# EAGLE design theFlower (EAGLE 6.5.0)
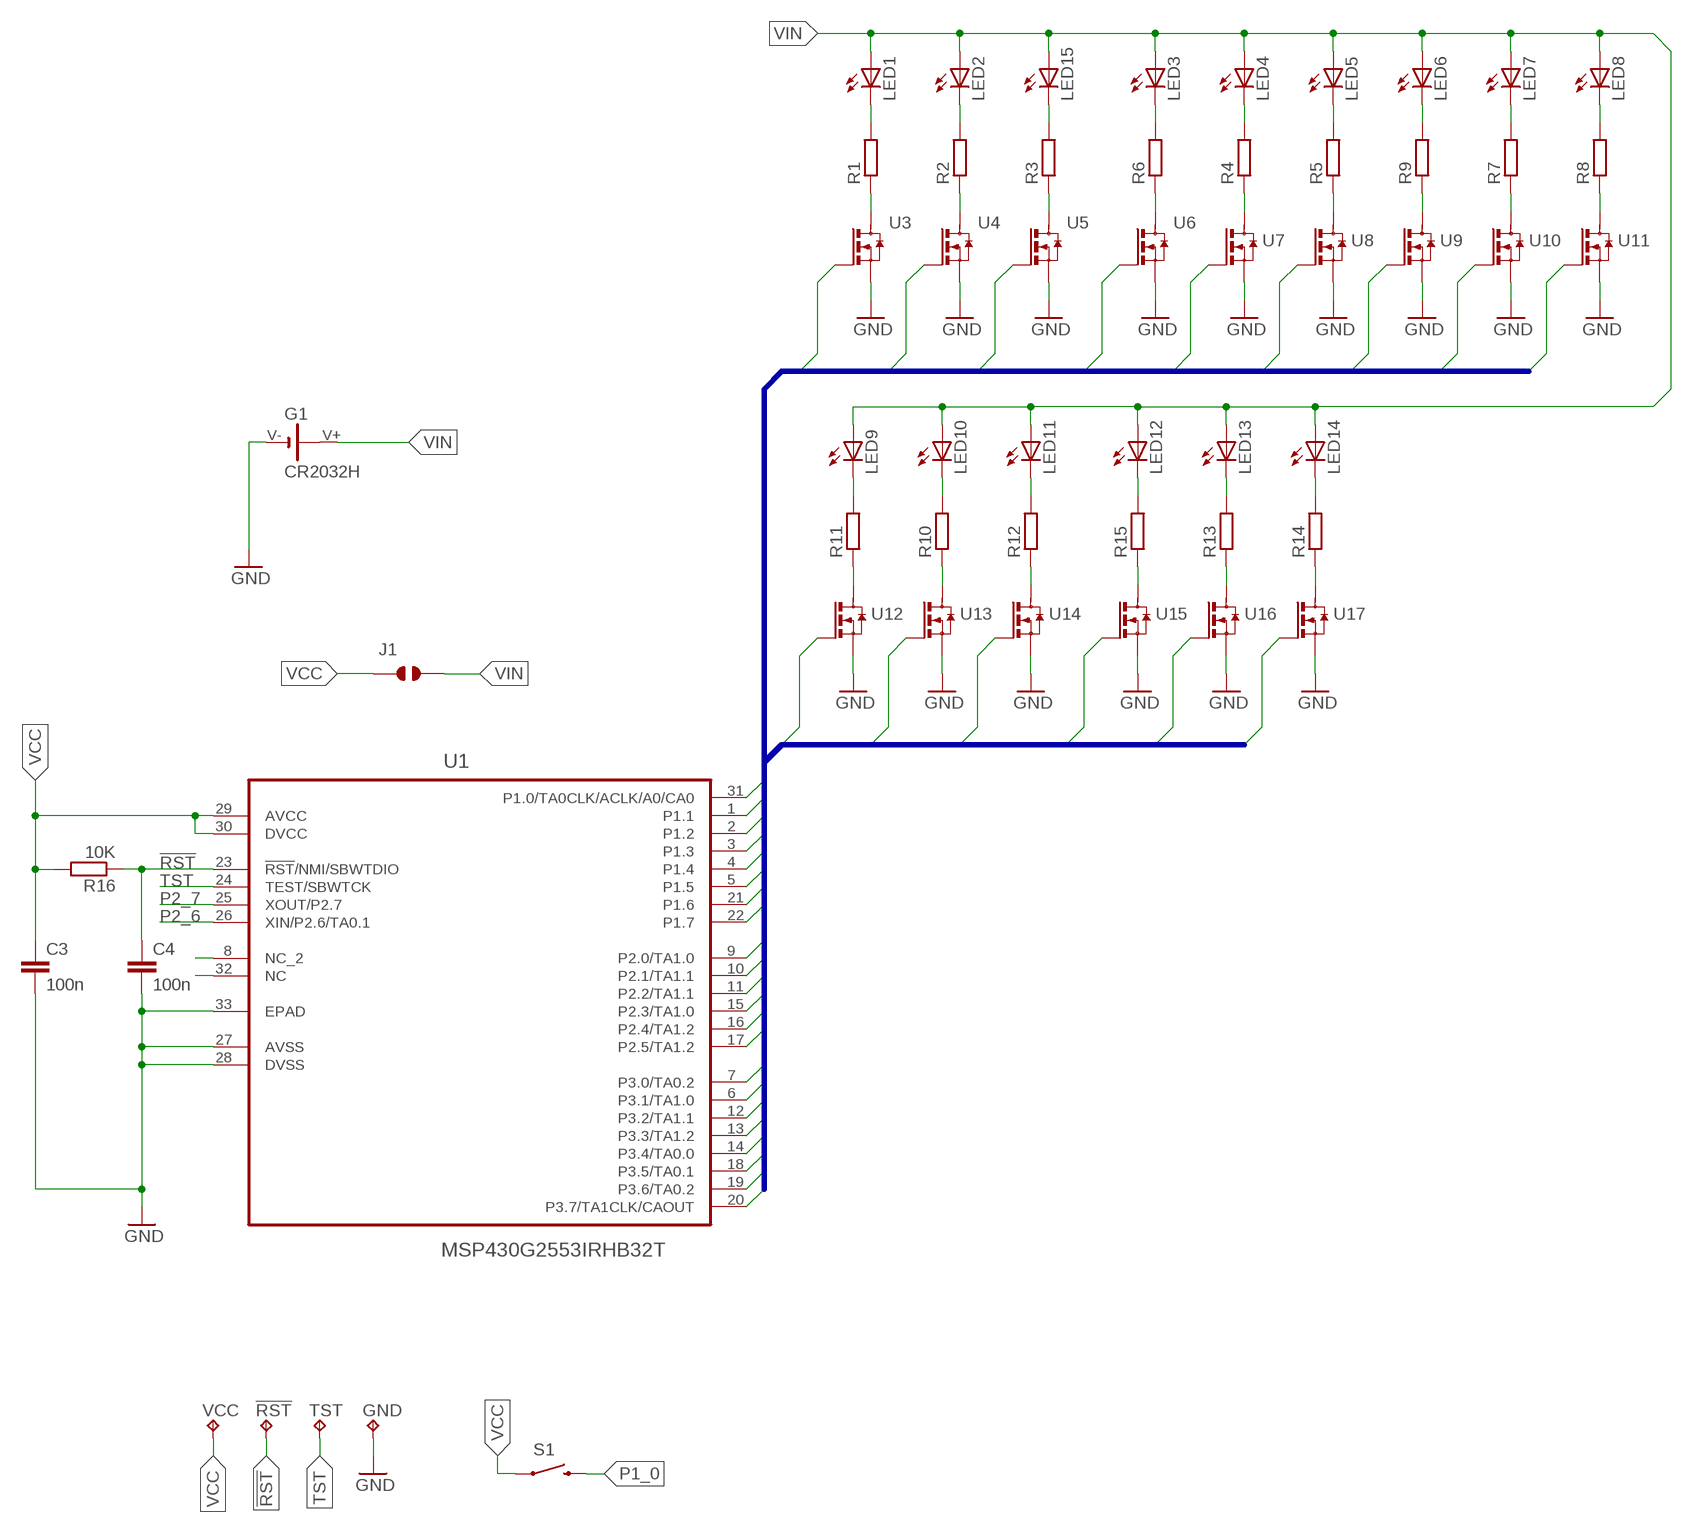
[diagram p0: schematic, sheet 1]

## Parts
!RST!  TPAD0.8MM_RUND  [TPAD_0.8MM_RUND]
C3  100n  C-EUC0603  [C0603]
C4  100n  C-EUC0603  [C0603]
G1  CR2032H  [CH7410-2032LF]
GND  TPAD0.8MM_RUND  [TPAD_0.8MM_RUND]
J1  JUMPER_SOLDER_1X2  [JUMPER_SOLDER_1X2]
LED1  LEDCHIP-LED0805  [CHIP-LED0805]
LED2  LEDCHIP-LED0805  [CHIP-LED0805]
LED3  LEDCHIP-LED0805  [CHIP-LED0805]
LED4  LEDCHIP-LED0805  [CHIP-LED0805]
LED5  LEDCHIP-LED0805  [CHIP-LED0805]
LED6  LEDCHIP-LED0805  [CHIP-LED0805]
LED7  LEDCHIP-LED0805  [CHIP-LED0805]
LED8  LEDCHIP-LED0805  [CHIP-LED0805]
LED9  LEDCHIP-LED0805  [CHIP-LED0805]
LED10  LEDCHIP-LED0805  [CHIP-LED0805]
LED11  LEDCHIP-LED0805  [CHIP-LED0805]
LED12  LEDCHIP-LED0805  [CHIP-LED0805]
LED13  LEDCHIP-LED0805  [CHIP-LED0805]
LED14  LEDCHIP-LED0805  [CHIP-LED0805]
LED15  LEDCHIP-LED0805  [CHIP-LED0805]
R1  R-EU_R0603  [R0603]
R2  R-EU_R0603  [R0603]
R3  R-EU_R0603  [R0603]
R4  R-EU_R0603  [R0603]
R5  R-EU_R0603  [R0603]
R6  R-EU_R0603  [R0603]
R7  R-EU_R0603  [R0603]
R8  R-EU_R0603  [R0603]
R9  R-EU_R0603  [R0603]
R10  R-EU_R0603  [R0603]
R11  R-EU_R0603  [R0603]
R12  R-EU_R0603  [R0603]
R13  R-EU_R0603  [R0603]
R14  R-EU_R0603  [R0603]
R15  R-EU_R0603  [R0603]
R16  10K  R-EU_R0603  [R0603]
S1  SWITCH-MOMENTARY-2SMD  [TACTILE-SWITCH-SMD]
TST  TPAD0.8MM_RUND  [TPAD_0.8MM_RUND]
U1  MSP430G2553IRHB32T  [QFN50P500X500X100-33N]
U3  BSS138BKW  [SOT65P210X110-3N]
U4  BSS138BKW  [SOT65P210X110-3N]
U5  BSS138BKW  [SOT65P210X110-3N]
U6  BSS138BKW  [SOT65P210X110-3N]
U7  BSS138BKW  [SOT65P210X110-3N]
U8  BSS138BKW  [SOT65P210X110-3N]
U9  BSS138BKW  [SOT65P210X110-3N]
U10  BSS138BKW  [SOT65P210X110-3N]
U11  BSS138BKW  [SOT65P210X110-3N]
U12  BSS138BKW  [SOT65P210X110-3N]
U13  BSS138BKW  [SOT65P210X110-3N]
U14  BSS138BKW  [SOT65P210X110-3N]
U15  BSS138BKW  [SOT65P210X110-3N]
U16  BSS138BKW  [SOT65P210X110-3N]
U17  BSS138BKW  [SOT65P210X110-3N]
VCC  TPAD0.8MM_RUND  [TPAD_0.8MM_RUND]

## Nets
!RST!: !RST!.1(TP) C4.1 R16.1 U1.23(!RST!/NMI/SBWTDIO)
GND: C3.2 C4.2 G1.V- GND.1(TP) U1.27(AVSS) U1.28(DVSS) U1.33(EPAD) U3.2(S) U4.2(S) U5.2(S) U6.2(S) U7.2(S) U8.2(S) U9.2(S) U10.2(S) U11.2(S) U12.2(S) U13.2(S) U14.2(S) U15.2(S) U16.2(S) U17.2(S)
N$1: LED1.C R1.2
N$2: LED2.C R2.2
N$3: LED15.C R3.2
N$4: LED4.C R4.2
N$5: LED5.C R5.2
N$6: LED3.C R6.2
N$7: LED7.C R7.2
N$8: LED8.C R8.2
N$9: LED6.C R9.2
N$10: LED10.C R10.2
N$11: LED9.C R11.2
N$12: LED11.C R12.2
N$13: LED13.C R13.2
N$14: LED14.C R14.2
N$15: LED12.C R15.2
N$16: R1.1 U3.3(D)
N$17: R2.1 U4.3(D)
N$18: R3.1 U5.3(D)
N$19: R6.1 U6.3(D)
N$20: R4.1 U7.3(D)
N$21: R5.1 U8.3(D)
N$22: R9.1 U9.3(D)
N$24: R7.1 U10.3(D)
N$25: R8.1 U11.3(D)
N$26: R11.1 U12.3(D)
N$27: R10.1 U13.3(D)
N$28: R12.1 U14.3(D)
N$29: R15.1 U15.3(D)
N$30: R13.1 U16.3(D)
N$31: R14.1 U17.3(D)
NC: U1.32(NC)
NC_2: U1.8(NC_2)
P1_0: S1.3 U1.31(P1.0/TA0CLK/ACLK/A0/CA0)
P1_1: U1.1(P1.1) U5.1(G)
P1_2: U1.2(P1.2) U3.1(G)
P1_3: U1.3(P1.3) U4.1(G)
P1_4: U1.4(P1.4) U6.1(G)
P1_5: U1.5(P1.5) U7.1(G)
P1_6: U1.21(P1.6) U16.1(G)
P1_7: U1.22(P1.7) U17.1(G)
P2_0: U1.9(P2.0/TA1.0) U10.1(G)
P2_1: U1.10(P2.1/TA1.1) U11.1(G)
P2_2: U1.11(P2.2/TA1.1) U12.1(G)
P2_3: U1.15(P2.3/TA1.0)
P2_4: U1.16(P2.4/TA1.2)
P2_5: U1.17(P2.5/TA1.2)
P2_6: U1.26(XIN/P2.6/TA0.1)
P2_7: U1.25(XOUT/P2.7)
P3_0: U1.7(P3.0/TA0.2) U9.1(G)
P3_1: U1.6(P3.1/TA1.0) U8.1(G)
P3_2: U1.12(P3.2/TA1.1) U13.1(G)
P3_3: U1.13(P3.3/TA1.2) U14.1(G)
P3_4: U1.14(P3.4/TA0.0)
P3_5: U1.18(P3.5/TA0.1)
P3_6: U1.19(P3.6/TA0.2)
P3_7: U1.20(P3.7/TA1CLK/CAOUT) U15.1(G)
TST: TST.1(TP) U1.24(TEST/SBWTCK)
VCC: C3.1 J1.1 R16.2 S1.1 U1.29(AVCC) U1.30(DVCC) VCC.1(TP)
VIN: G1.V+ J1.2 LED1.A LED2.A LED3.A LED4.A LED5.A LED6.A LED7.A LED8.A LED9.A LED10.A LED11.A LED12.A LED13.A LED14.A LED15.A

## Buses
P1_[0..7],P2_[0..5],P3_[0..7]

## Library data of the parts
!RST! GND TST VCC = MOT_GPDLV-V2:TPAD
C3 C4 = rcl:C-EU: CAPACITOR, European symbol
G1 = my_library:CR2032H: LI BATTERY Varta
J1 = dp_devices:JUMPER_SOLDER_1X2
LED1-LED15 = led:LED: LED OSRAM: - CHIPLED LG R971, LG N971, LY N971, LG Q971, LY Q971, LO R971, LY R971 LH N974, LH R974 LS Q976, LO Q976, LY Q976 LO Q996 - Hyper CHIPLED LW Q18S LB Q993, LB Q99A, LB R99A - SideLED LS A670, LO A670, LY A670, LG A670, LP A670 LB A673, LV A673, LT A673, LW A673 LH A674 LY A675 LS A676, LA A676, LO A676, LY A676, LW A676 LS A679, LY A679, LG A679 - Hyper Micro SIDELED® LS Y876, LA Y876, LO Y876, LY Y876 LT Y87S - SmartLED LW L88C, LW L88S LB L89C, LB L89S, LG L890 LS L89K, LO L89K, LY L89K LS L896, LA L896, LO L896, LY L896 - TOPLED LS T670, LO T670, LY T670, LG T670, LP T670 LSG T670, LSP T670, LSY T670, LOP T670, LYG T670 LG T671, LOG T671, LSG T671 LB T673, LV T673, LT T673, LW T673 LH T674 LS T676, LA T676, LO T676, LY T676, LB T676, LH T676, LSB T676, LW T676 LB T67C, LV T67C, LT T67C, LS T67K, LO T67K, LY T67K, LW E67C LS E67B, LA E67B, LO E67B, LY E67B, LB E67C, LV E67C, LT E67C LW T67C LS T679, LY T679, LG T679 LS T770, LO T770, LY T770, LG T770, LP T770 LB T773, LV T773, LT T773, LW T773 LH T774 LS E675, LA E675, LY E675, LS T675 LS T776, LA T776, LO T776, LY T776, LB T776 LHGB T686 LT T68C, LB T68C - Hyper Mini TOPLED® LB M676 - Mini TOPLED Santana® LG M470 LS M47K, LO M47K, LY M47K Source: http://www.osram.convergy.de LUXEON: - LUMILED® LXK2-PW12-R00, LXK2-PW12-S00, LXK2-PW14-U00, LXK2-PW14-V00 LXK2-PM12-R00, LXK2-PM12-S00, LXK2-PM14-U00 LXK2-PE12-Q00, LXK2-PE12-R00, LXK2-PE12-S00, LXK2-PE14-T00, LXK2-PE14-U00 LXK2-PB12-K00, LXK2-PB12-L00, LXK2-PB12-M00, LXK2-PB14-N00, LXK2-PB14-P00, LXK2-PB14-Q00 LXK2-PR12-L00, LXK2-PR12-M00, LXK2-PR14-Q00, LXK2-PR14-R00 LXK2-PD12-Q00, LXK2-PD12-R00, LXK2-PD12-S00 LXK2-PH12-R00, LXK2-PH12-S00 LXK2-PL12-P00, LXK2-PL12-Q00, LXK2-PL12-R00 Source: www.luxeon.com KINGBRIGHT: KA-3528ASYC Source: www.kingbright.com
R1-R16 = rcl:R-EU_: RESISTOR, European symbol
S1 = SparkFun-Electromechanical:SWITCH-MOMENTARY-2: Various NO switches- pushbuttons, reed, etc; PROD_ID: SWCH-08247
U1 = my_library:MSP430G2553IRHB32T: MIXED SIGNAL MICROCONTROLLER,QFN-32; MPN: MSP430G2553IRHB32T; OC_FARNELL: 1903590; OC_NEWARK: 48T4379; PACKAGE: QFN-32; SUPPLIER: TEXAS INSTRUMENTS
U3-U17 = transistor-small-signal:BSS138BKW: N-channel Trench MOSFET; MPN: BSS138BKW; OC_FARNELL: 2053836; OC_NEWARK: 61T7488; PACKAGE: SOT-23-3; SUPPLIER: NXP

## Board
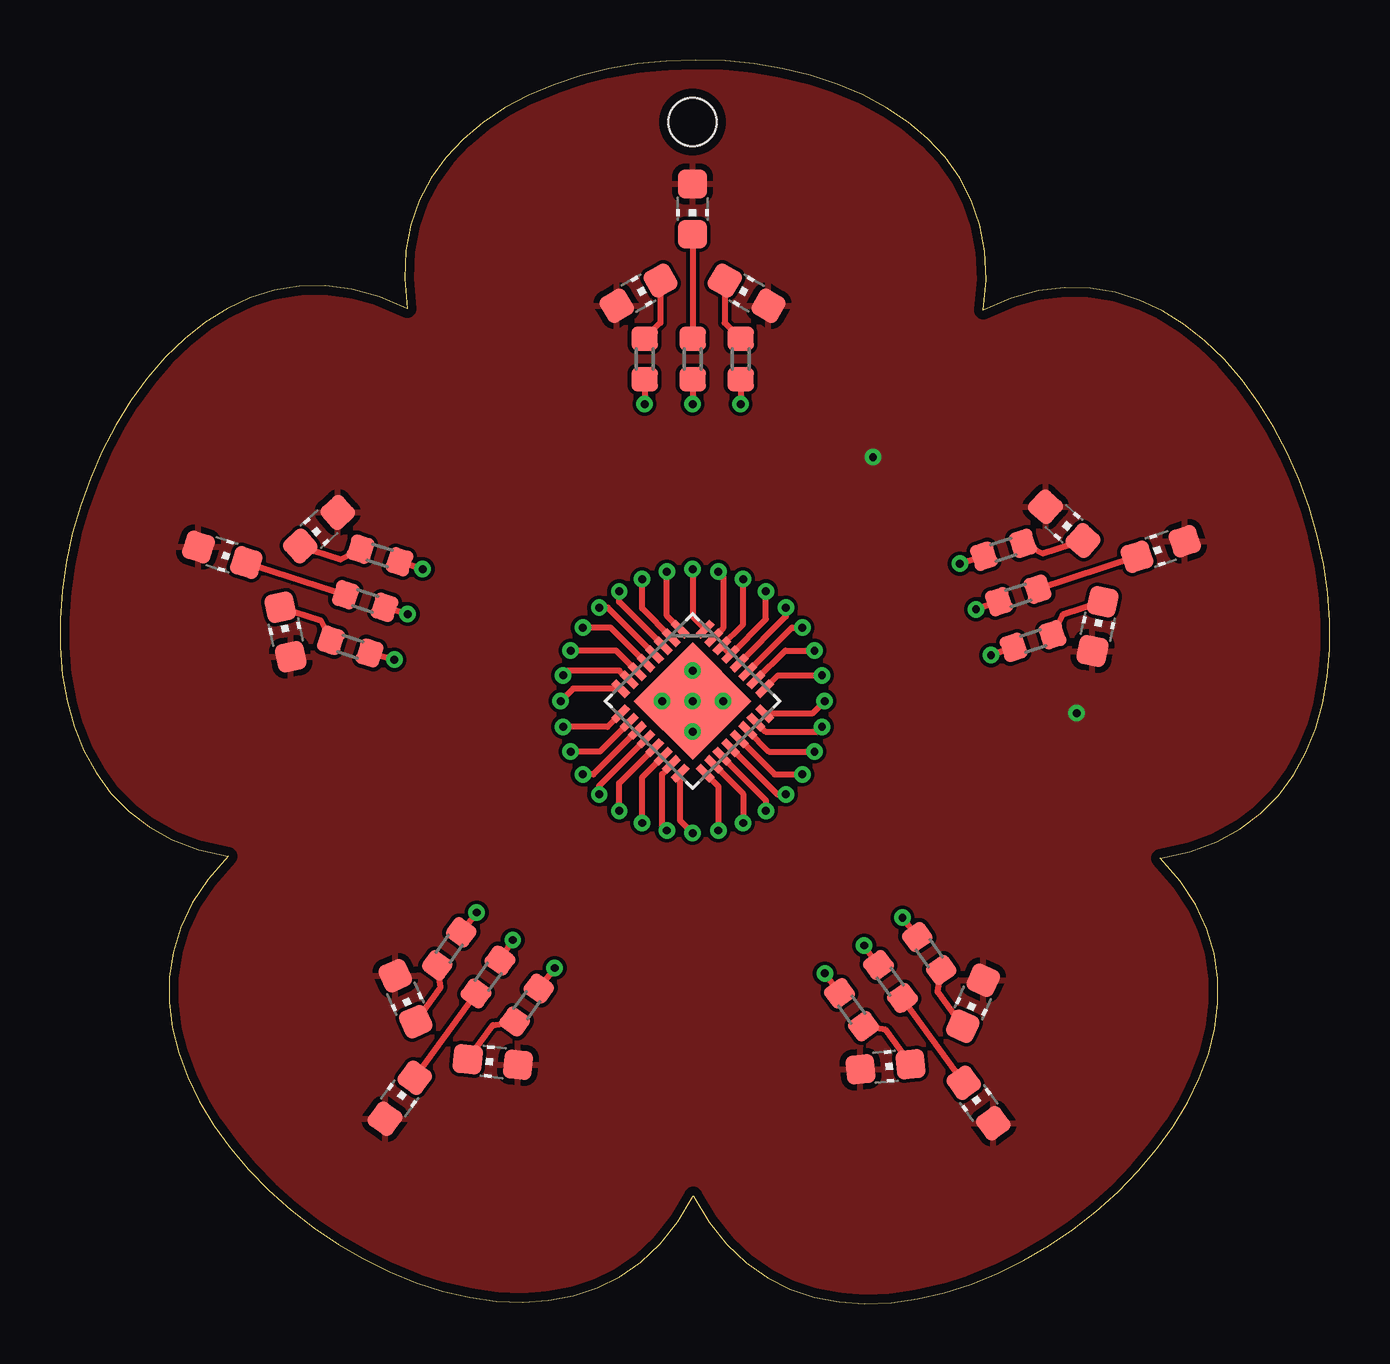
[diagram p1: board, top side]
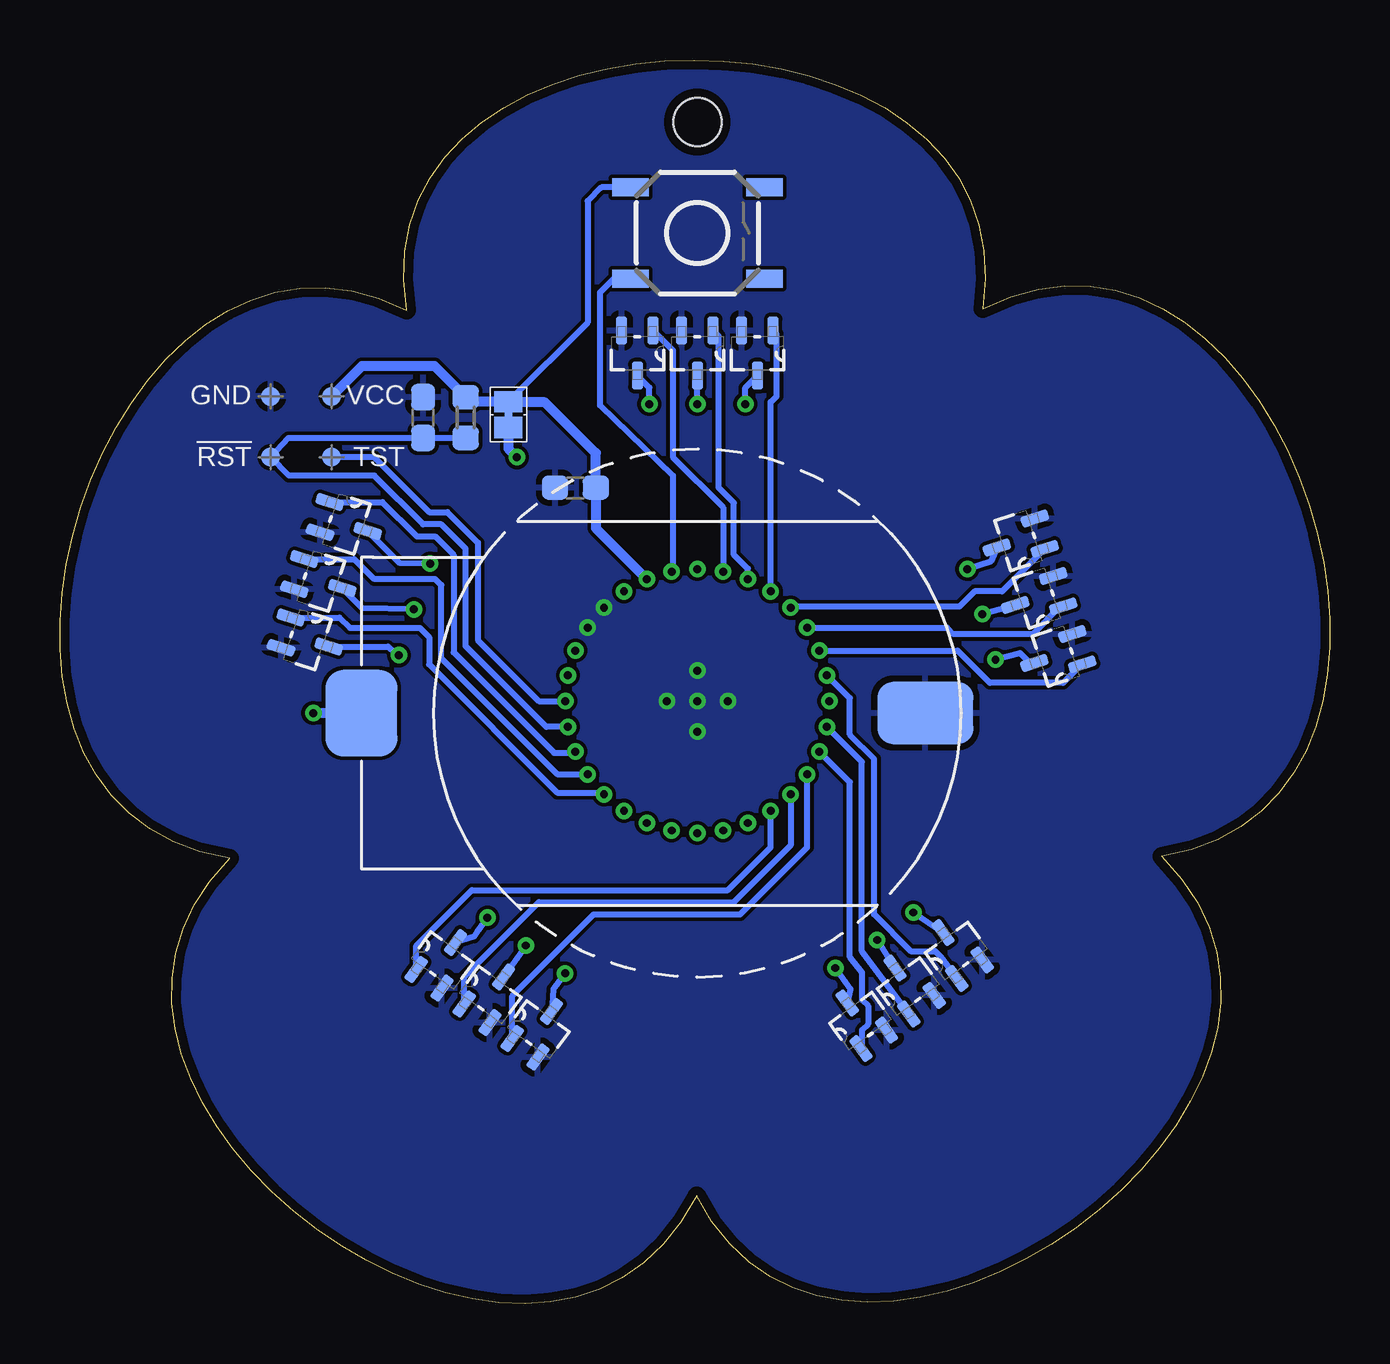
[diagram p2: board, bottom side, seen from below]

Size 52.91 x 51.82 mm. Coordinates in mm from the lower left corner, seen from the top.
Outline: 26.39,4.49 27.04,3.4 27.78,2.47 28.6,1.7 29.48,1.08 30.43,0.61 31.42,0.28 32.46,0.08 33.53,0 34.63,0.04 35.74,0.2 36.85,0.46 37.97,0.82 39.07,1.27 40.15,1.8 41.21,2.42 42.22,3.11 43.18,3.86 44.09,4.67 44.94,5.54 45.71,6.45 46.39,7.4 46.98,8.38 47.47,9.39 47.85,10.42 48.12,11.46 48.25,12.51 48.24,13.56 48.09,14.6 47.78,15.62 47.31,16.63 46.67,17.61 45.84,18.55 47.08,18.84 48.19,19.25 49.18,19.79 50.04,20.44 50.78,21.19 51.4,22.04 51.91,22.96 52.32,23.96 52.62,25.01 52.81,26.12 52.91,27.26 52.91,28.43 52.83,29.62 52.65,30.81 52.39,32 52.05,33.18 51.63,34.33 51.14,35.45 50.57,36.52 49.95,37.53 49.25,38.47 48.5,39.34 47.69,40.12 46.83,40.8 45.92,41.37 44.97,41.82 43.97,42.14 42.93,42.32 41.86,42.34 40.76,42.2 39.63,41.89 38.48,41.4 38.59,42.66 38.54,43.85 38.33,44.95 37.98,45.97 37.49,46.91 36.88,47.76 36.16,48.54 35.34,49.23 34.43,49.84 33.44,50.37 32.38,50.81 31.27,51.18 30.11,51.46 28.92,51.66 27.71,51.78 26.48,51.82 25.26,51.78 24.05,51.66 22.86,51.45 21.7,51.17 20.59,50.8 19.53,50.35 18.54,49.82 17.63,49.22 16.8,48.53 16.08,47.76 15.47,46.91 14.98,45.98 14.62,44.97 14.41,43.87 14.36,42.7 14.47,41.45 13.31,41.95 12.16,42.27 11.05,42.41 9.97,42.39 8.93,42.22 7.93,41.9 6.97,41.46 6.06,40.89 5.2,40.21 4.39,39.43 3.64,38.57 2.95,37.62 2.32,36.61 1.76,35.54 1.27,34.42 0.86,33.27 0.52,32.09 0.26,30.9 0.09,29.7 0,28.51 0,27.34 0.1,26.2 0.3,25.09 0.6,24.04 1,23.04 1.51,22.12 2.13,21.27 2.86,20.52 3.71,19.87 4.68,19.33 5.78,18.92 7.01,18.64 6.17,17.69 5.51,16.7 5.03,15.68 4.72,14.65 4.56,13.61 4.55,12.56 4.68,11.51 4.94,10.46 5.32,9.44 5.81,8.43 6.4,7.44 7.09,6.5 7.86,5.59 8.7,4.72 9.61,3.91 10.58,3.16 11.6,2.48 12.65,1.86 13.73,1.33 14.84,0.88 15.95,0.52 17.07,0.26 18.18,0.11 19.28,0.06 20.35,0.14 21.39,0.33 22.38,0.66 23.32,1.13 24.21,1.74 25.02,2.5 25.75,3.41 26.39,4.49
Copper layers (1*16): Top 0.0356mm / dielectric 1.5011mm / Bottom 0.0356mm
Design rules "LaenPCBOrder *": minimum track width 6mil, minimum drill 13mil, track to track 6mil, track to pad 6mil, pad to pad 6mil, via to via 6mil, smd to smd 6mil, copper to edge 15mil, drill to drill 6mil, minimum pad ring 7mil, minimum via ring 7mil, stop-mask expansion 3mil, vias tented up to drill 25mil, thermal gap 10mil
Holes 2 mm at 26.36,49.23

### Footprints (pad centres in the part's own frame; a part is rotated, then mirrored left to right if it is on the bottom)
TPAD_0.8MM_RUND = smd 0.8 x 0.8: 1 0,0
C0603 = smd 1.1 x 1: 1 -0.85,0; 2 0.85,0
CH7410-2032LF = smd 3 x 3.6: V+ -14,0 | smd 4 x 2.6: V- 9.5,0
JUMPER_SOLDER_1X2 = smd 0.889 x 1.168: 1 -0.533,0; 2 0.533,0 | smd 1.27 x 0.318: P$1 0,0
CHIP-LED0805 = smd 1.2 x 1.2: A 0,-1.05; C 0,1.05
R0603 = smd 1 x 1.1: 1 -0.85,0; 2 0.85,0
TACTILE-SWITCH-SMD = smd 1.524 x 0.762: 1 -2.794,1.905; 2 2.794,1.905; 3 -2.794,-1.905; 4 2.794,-1.905
QFN50P500X500X100-33N = smd 0.813 x 0.305: 1 -2.489,1.753; 2 -2.489,1.245; 3 -2.489,0.762; 4 -2.489,0.254; 5 -2.489,-0.254; 6 -2.489,-0.762; 7 -2.489,-1.245; 8 -2.489,-1.753; 17 2.489,-1.753; 18 2.489,-1.245; 19 2.489,-0.762; 20 2.489,-0.254; 21 2.489,0.254; 22 2.489,0.762; 23 2.489,1.245; 24 2.489,1.753 | smd 0.305 x 0.813: 9 -1.753,-2.489; 10 -1.245,-2.489; 11 -0.762,-2.489; 12 -0.254,-2.489; 13 0.254,-2.489; 14 0.762,-2.489; 15 1.245,-2.489; 16 1.753,-2.489; 25 1.753,2.489; 26 1.245,2.489; 27 0.762,2.489; 28 0.254,2.489; 29 -0.254,2.489; 30 -0.762,2.489; 31 -1.245,2.489; 32 -1.753,2.489 | smd 3.454 x 3.454: 33 0,0
SOT65P210X110-3N = smd 1.168 x 0.457: 1 -0.94,0.66; 2 -0.94,-0.66; 3 0.94,0

### Placement (x,y rotation side)
!RST!  44.14,35.27 0 bottom
C3  31.44,34 180 bottom
C4  37.79,36.92 90 bottom
G1  26.36,24.61 0 bottom
GND  44.14,37.81 0 bottom
J1  34.23,37.05 270 bottom
LED1  26.36,45.61 180 top
LED2  24.11,42.11 300 top
LED3  10.79,32.27 132 top
LED4  6.77,31.21 252 top
LED5  9.4,27.99 12 top
LED6  14.4,12.72 204 top
LED7  14.16,8.56 324 top
LED8  18.04,10.07 84 top
LED9  34.4,9.87 276 top
LED10  38.27,8.36 36 top
LED11  38.04,12.52 156 top
LED12  43.24,28.22 348 top
LED13  45.87,31.44 108 top
LED14  41.85,32.5 228 top
LED15  28.61,42.11 60 top
R1  26.36,39.36 90 top
R2  24.36,39.36 90 top
R3  28.36,39.36 90 top
R4  12.71,29.28 162 top
R5  12.09,27.37 162 top
R6  13.33,31.18 162 top
R7  17.83,13.62 234 top
R8  19.45,12.44 234 top
R9  16.22,14.79 234 top
R10  34.6,13.42 306 top
R11  32.98,12.25 306 top
R12  36.22,14.6 306 top
R13  39.93,29.51 18 top
R14  39.31,31.41 18 top
R15  40.54,27.61 18 top
R16  36.01,36.92 90 bottom
S1  26.36,44.61 0 bottom
TST  41.6,35.27 0 bottom
U1  26.36,25.11 315 top
U3  26.36,39.61 270 bottom
U4  23.86,39.61 270 bottom
U5  28.86,39.61 270 bottom
U6  12.98,31.8 198 bottom
U7  12.21,29.4 198 bottom
U8  11.42,26.98 198 bottom
U9  15.57,14.7 126 bottom
U10  17.57,13.22 126 bottom
U11  19.56,11.77 126 bottom
U12  32.98,11.42 54 bottom
U13  34.98,12.86 54 bottom
U14  36.98,14.3 54 bottom
U15  42.61,27.67 342 bottom
U16  42.05,30.11 342 bottom
U17  40.98,32.48 342 bottom
VCC  41.6,37.81 0 bottom

### Tracks (layer width: path | path; a pad name or v marks a point on that pad's centre or on a via)
!RST!  (via drill 0.33)
  Top 0.254: U1.23 29.39,23.84 31.55,23.84 v31.75,24.04
  Bottom 0.254: v31.75,24.04 32.65,24.04 36.01,27.4 36.01,31.46 37.03,32.48 37.79,32.48 39.82,34.51 43.38,34.51 !RST!.1 43.4,36.07 C4.1 R16.1
GND  (via drill 0.33, 0.33 pad 0.51)
  Top 0.254: U1.27 30.49,28.17 v30.93,28.17 | U1.28 30.25,28.64 v30.25,29
  other vias: 27.63,25.11 26.36,26.38 25.09,25.11 26.36,23.84 26.36,25.11
  pour Bottom (isolate 0.152): -1.14,-2.39 53.86,-2.39 53.86,52.61 -1.14,52.61
N$1
  Top 0.254: LED1.C R1.2
N$2
  Top 0.254: LED2.C 25.02,40.87 R2.2
N$3
  Top 0.254: LED15.C 27.7,40.87 R3.2
N$4
  Top 0.254: LED4.C R4.2
N$5
  Top 0.254: LED5.C 10.86,28.47 R5.2
N$6
  Top 0.254: LED3.C 11.69,31.02 R6.2
N$7
  Top 0.254: LED7.C R7.2
N$8
  Top 0.254: LED8.C 18.03,11.61 R8.2
N$9
  Top 0.254: LED6.C 15.86,13.18 R9.2
N$10
  Top 0.254: LED10.C R10.2
N$11
  Top 0.254: LED9.C 34.4,11.41 R11.2
N$12
  Top 0.254: LED11.C 36.57,12.99 R12.2
N$13
  Top 0.254: LED13.C R13.2
N$14
  Top 0.254: LED14.C 40.95,31.25 R14.2
N$15
  Top 0.254: LED12.C 41.78,28.7 R15.2
N$16  (via drill 0.33 pad 0.51)
  Top 0.254: R1.1 v26.36,37.48
  Bottom 0.254: v26.36,37.48 U3.3
N$17  (via drill 0.33 pad 0.51)
  Top 0.254: R2.1 v24.36,37.48
  Bottom 0.254: v24.36,37.48 24.36,38.17 U4.3
N$18  (via drill 0.33 pad 0.51)
  Top 0.254: R3.1 v28.36,37.48
  Bottom 0.254: v28.36,37.48 28.36,38.17 U5.3
N$19  (via drill 0.33 pad 0.51)
  Top 0.254: v15.11,30.61 R6.1
  Bottom 0.254: U6.3 R6.1 v15.11,30.61
N$20  (via drill 0.33 pad 0.51)
  Top 0.254: v14.48,28.73 R4.1
  Bottom 0.254: U7.3 v14.48,28.73
N$21  (via drill 0.33 pad 0.51)
  Top 0.254: v13.94,26.83 R5.1
  Bottom 0.254: U8.3 12.49,26.69 R5.1 v13.94,26.83
N$22  (via drill 0.33 pad 0.51)
  Top 0.254: v17.36,16.3 R9.1
  Bottom 0.254: U9.3 v17.36,16.3
N$24  (via drill 0.33 pad 0.51)
  Top 0.254: R7.1 v18.86,15.15
  Bottom 0.254: v18.86,15.15 U10.3
N$25  (via drill 0.33 pad 0.51)
  Top 0.254: R8.1 v20.61,13.99
  Bottom 0.254: v20.61,13.99 19.98,13.11 U11.3
N$26  (via drill 0.33 pad 0.51)
  Top 0.254: R11.1 v31.87,13.76
  Bottom 0.254: v31.87,13.76 32.36,13.11 U12.3
N$27  (via drill 0.33 pad 0.51)
  Top 0.254: R10.1 v33.51,14.92
  Bottom 0.254: v33.51,14.92 U13.3
N$28  (via drill 0.33 pad 0.51)
  Top 0.254: R12.1 v35.11,16.09
  Bottom 0.254: v35.11,16.09 35.55,15.48 35.67,15.3 U14.3
N$29  (via drill 0.33 pad 0.51)
  Top 0.254: R15.1 v38.79,27.02
  Bottom 0.254: U15.3 39.25,27.38 v38.79,27.02
N$30  (via drill 0.33 pad 0.51)
  Top 0.254: R13.1 v38.17,28.93
  Bottom 0.254: v38.17,28.93 40.32,28.98 U16.3
N$31  (via drill 0.33 pad 0.51)
  Top 0.254: R14.1 v37.49,30.83
  Bottom 0.254: v37.49,30.83 38.75,30.86 U17.3
NC  (via drill 0.33)
  Top 0.254: v26.36,30.61 26.36,28.63 U1.32
NC_2  (via drill 0.33)
  Top 0.254: U1.8 21.38,25.63 v20.86,25.11
P1_0  (via drill 0.33)
  Top 0.254: U1.31 27.63,28.14 27.63,30.31 v27.43,30.5
  Bottom 0.254: S1.3 29.84,42.7 30.42,42.13 30.42,37.43 27.37,34.51 27.37,30.56 v27.43,30.5
P1_1  (via drill 0.33)
  Top 0.254: U1.1 25.28,28.66 v25.28,30.5
  Bottom 0.254: U5.1 27.37,39.73 27.37,35.27 25.28,33.18 v25.28,30.5
P1_2  (via drill 0.33)
  Top 0.254: U1.2 24.25,28.97 v24.25,30.19
  Bottom 0.254: v24.25,30.19 24.25,30.62 24.83,31.21 24.83,33.36 25.47,34 25.47,40.32 U3.1
P1_3  (via drill 0.33)
  Top 0.254: U1.3 23.3,29.24 v23.3,29.68
  Bottom 0.254: v23.3,29.68 23.3,37.56 23.06,37.81 23.06,40.41 U4.1
P1_4  (via drill 0.33)
  Top 0.254: U1.4 22.83,29 v22.47,29
  Bottom 0.254: U6.1 13.66,29.68 14.8,29.68 15.44,29.05 22.42,29.05 v22.47,29
P1_5  (via drill 0.33)
  Top 0.254: U1.5 22.94,28.17 v21.78,28.17
  Bottom 0.254: U7.1 11.23,29.06 12.39,27.9 15.69,27.9 15.95,28.17 v21.78,28.17
P1_6  (via drill 0.33)
  Top 0.254: U1.21 29.77,22.05 v30.93,22.05
  Bottom 0.254: U16.1 40.66,31.03 39.82,30.19 37.28,30.19 37.03,29.94 37.03,26.89 32.2,22.06 30.94,22.06 v30.93,22.05
P1_7  (via drill 0.33)
  Top 0.254: U1.22 29.54,23 v31.44,23
  Bottom 0.254: U17.1 39.48,33.4 38.04,31.97 37.28,31.97 36.52,31.21 36.52,27.14 32.33,22.95 31.49,22.95 v31.44,23
P2_0  (via drill 0.33)
  Top 0.254: U1.9 22.81,24.04 v20.96,24.04
  Bottom 0.254: v20.96,24.04 19.5,22.57 19.5,14.7 U10.1
P2_1  (via drill 0.33)
  Top 0.254: U1.10 22.49,23 v21.28,23
  Bottom 0.254: 19.54,10.68 U11.1 19.5,10.67 19.5,11.39 19.25,11.65 19.25,12.41 19.5,12.66 19.5,13.81 20.01,14.44 20.01,21.74 v21.28,23
P2_2  (via drill 0.33)
  Top 0.254: U1.11 22.22,22.05 v21.78,22.05
  Bottom 0.254: U12.1 34.07,12.83 30.68,16.22 24.58,16.22 21.79,19.01 v21.79,22.05 v21.78,22.05
P2_3  (via drill 0.33)
  Top 0.254: v25.28,19.72 25.09,19.91 25.09,22.06 25.48,22.45 U1.15
P2_4  (via drill 0.33)
  Top 0.254: v26.36,19.61 25.84,20.13 U1.16
P2_5  (via drill 0.33)
  Top 0.254: U1.17 27.43,21.56 v27.43,19.72
P2_6  (via drill 0.33)
  Top 0.254: U1.26 30.22,27.21 v31.44,27.21
P2_7  (via drill 0.33)
  Top 0.254: U1.25 29.91,26.18 v31.75,26.18
P3_0  (via drill 0.33)
  Top 0.254: U1.7 23.7,25.99 23.31,26.38 21.16,26.38 v20.96,26.18
  Bottom 0.254: v20.96,26.18 20.01,25.23 20.01,23.71 18.99,22.7 18.99,16.22 17.47,14.7 16.45,14.7 16.2,14.44 U9.1
P3_1  (via drill 0.33)
  Top 0.254: U1.6 23.18,27.21 v21.28,27.21
  Bottom 0.254: U8.1 10.34,26.65 11.12,25.87 14.17,25.87 15.51,27.21 v21.28,27.21
P3_2  (via drill 0.33)
  Top 0.254: U1.12 22.47,21.58 v22.47,21.22
  Bottom 0.254: U13.1 36.07,13.62 32.96,16.73 24.83,16.73 22.47,19.09 v22.47,21.22
P3_3  (via drill 0.33)
  Top 0.254: v23.3,20.54 23.3,21.69 U1.13
  Bottom 0.254: U14.1 38.07,14.92 35.76,17.24 25.09,17.24 23.31,19.01 23.31,20.53 v23.3,20.54
P3_4  (via drill 0.33)
  Top 0.254: v24.25,20.03 24.25,21.93 U1.14
P3_5  (via drill 0.33)
  Top 0.254: U1.18 28.46,21.24 v28.46,20.03
P3_6  (via drill 0.33)
  Top 0.254: U1.19 29.41,20.98 v29.41,20.54
P3_7  (via drill 0.33)
  Top 0.254: U1.20 29.89,21.22 v30.25,21.22
  Bottom 0.254: U15.1 41.27,28.59 40.84,28.16 37.91,28.16 37.53,27.78 37.53,26.63 32.2,21.3 30.33,21.3 v30.25,21.22
TST  (via drill 0.33)
  Top 0.254: v31.86,25.11 31.34,24.59 U1.24
  Bottom 0.254: v31.86,25.11 32.96,25.11 35.5,27.65 35.5,31.71 36.77,32.98 37.53,32.98 39.82,35.27 TST.1
VCC  (via drill 0.33)
  Top 0.254: v28.46,30.19 28.46,28.29 U1.30 U1.29 | U1.29 29.41,28.52 v29.41,29.68 | U1.29
  Bottom 0.254: S1.1 30.35,46.51 30.93,45.94 30.93,40.88 J1.1
  Bottom 0.406: v29.41,29.68 29.53,29.68 | v28.46,30.19 30.59,32.32 C3.1 30.59,35.44 32.71,37.56 34.21,37.56 J1.1 35.82,37.58 R16.2 37.32,39.08 40.33,39.08 VCC.1
VIN  (via drill 0.33, 0.33 pad 0.51)
  Bottom 0.406: G1.V+ v42.36,24.61 | J1.2 34.23,35.63 v33.88,35.27
  pour Top (isolate 0.152): -1.14,-2.39 53.86,-2.39 53.86,52.61 -1.14,52.61